# Altium schematic sheet PowerConversion.SchDoc
size B
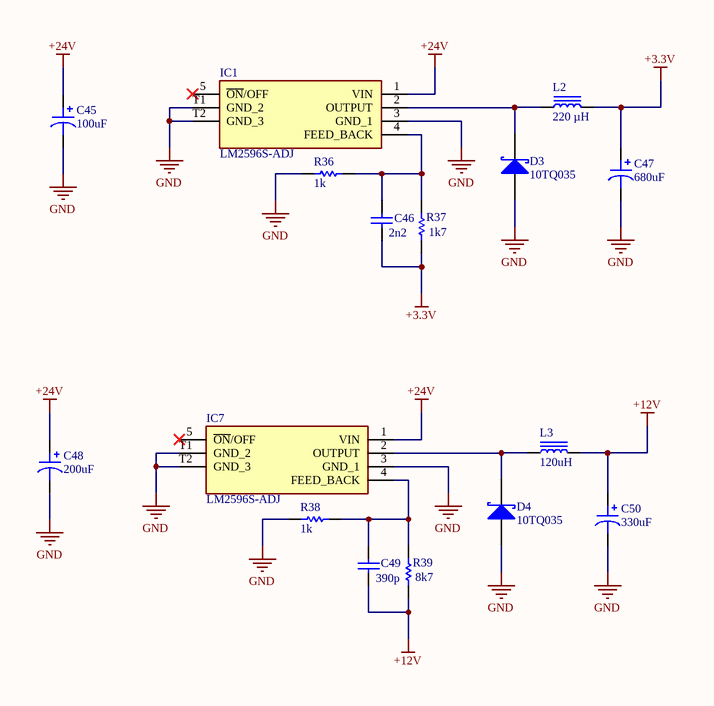
[diagram p0: PowerConversion.SchDoc]

## Parts
C45  100uF  [CAP ALSMD 8.3MM H10.5MM]
C46  value 2n2  [RAD-0.3]  (hidden comment: Cap)
C47  680uF  [CAP ALSMD 8.3MM H10.5MM]
C48  200uF  [CAP ALSMD 8.3MM H10.5MM]
C49  value 390p  [RAD-0.3]  (hidden comment: Cap)
C50  330uF  [CAP ALSMD 8.3MM H10.5MM]
D3  10TQ035  [TO-220AC]
D4  10TQ035  [TO-220AC]
IC1  LM2596S-ADJ  [LM2596SXADJ]
IC7  LM2596S-ADJ  [LM2596SXADJ]
L2  220 µH  [WURTH WE-PD 1260]
L3  120uH  [WURTH WE-PD 1260]
R36  value 1k  [AXIAL-0.3]  (hidden comment: Res1)
R37  value 1k7  [AXIAL-0.3]  (hidden comment: Res1)
R38  value 1k  [AXIAL-0.3]  (hidden comment: Res1)
R39  value 8k7  [AXIAL-0.3]  (hidden comment: Res1)

## Nets
+3.3V: C46.1 C47.1 L2.2 R37.1
+12V: C49.1 C50.1 L3.2 R39.1
+24V: C45.1 C48.1 IC1.1(VIN) IC7.1(VIN)
GND: C45.2 C47.2 C48.2 C50.2 D3.3(A) D4.3(A) IC1.3(GND_1) IC1.T1(GND_2) IC1.T2(GND_3) IC7.3(GND_1) IC7.T1(GND_2) IC7.T2(GND_3) R36.2 R38.2
NetC46_2: C46.2 IC1.4(FEED_BACK) R36.1 R37.2
NetC49_2: C49.2 IC7.4(FEED_BACK) R38.1 R39.2
NetD3_1: D3.1(K) IC1.2(OUTPUT) L2.1
NetD4_1: D4.1(K) IC7.2(OUTPUT) L3.1

Not connected (* = marked no-connect by the designer): IC1 5(~{ON}/OFF)*; IC7 5(~{ON}/OFF)*

## Library data of the parts
C45 C47 C48 C50 = UUX1V101MNL6GS: CAP ALUM 100UF 20% 35V SMD; manufacturer: Nichicon; Capacitance: 100µF; Lifetime @ Temp.: 2000 Hrs @ 105°C; Polarization: Polar; Ripple Current @ High Frequency: 367.9mA @ 10kHz; Ripple Current @ Low Frequency: 283mA @ 120Hz; Surface Mount Land Size: 0.327" L x 0.327" W (8.30mm x 8.30mm); value: 100µF; Part Number: UUX1V101MNL6GS; Applications: General Purpose; componentlink1description: Datasheet; componentlink1url: http://nichicon-us.com/english/products/pdfs/e-uux.pdf; componentlink2description: DigiKey Link; componentlink2url: http://digikey.com/product-detail/en/nichicon/UUX1V101MNL6GS/493-6276-1-ND/3438789; Device Package: Radial, Can - SMD; Height - Seated (Max): 0.413" (10.50mm); lastupdated: 02.09.2020 01:25:15; Lifecycle Status: Active; Minimum Order: 1; Mounting Type: Surface Mount; Operating Temperature: -55°C ~ 105°C; Package / Case: Radial, Can - SMD; packaging: TapeAndReel; partid: 7565; Part Status: Active; price: 0.19; series: UUX; Size / Dimension: 0.315" Dia (8.00mm); Supplier 1: DigiKey; Supplier Part Number 1: 493-6276-1-ND; Tolerance: ±20%; Voltage - Rated: 35V
C46 C49 = Cap: Capacitor; Published: 8-Jun-2000; LatestRevisionDate: 17-Jul-2002; LatestRevisionNote: Re-released for DXP Platform.; PackageReference: RAD-0.3; Publisher: Altium Limited; PackageDescription: Radial Cap, Thru-Hole; 2 Leads; 0.3 in Pin Spacing
D3 D4 = Diode 10TQ035: Schottky Rectifier; Note: Terminal 2 is the TAB and is electrically connected to the cathode; Published: 8-Jun-2000; LatestRevisionDate: 17-Jul-2002; LatestRevisionNote: Re-released for DXP Platform.; DatasheetVersion: PD-2.057B; PackageVersion: Feb-1998; PackageReference: TO-220AC; Publisher: Altium Limited; PackageDescription: TO, Thru-Hole, Vertical, Heatsink Mounted; 3 In-Line Leads (1 Absent); Pitch 2.54 mm; ComponentLink1Description: Manufacturer Link; ComponentLink1URL: http://www.irf.com/; ComponentLink2Description: Datasheet; ComponentLink2URL: http://www.irf.com/product-info/datasheets/data/10tq.pdf
IC1 IC7 = LM2596S-ADJ: Integrated Circuit; Manufacturer_Name: Texas Instruments; Datasheet Link: https://www.ti.com/lit/ds/symlink/lm2596.pdf?HQS=ti-null-null-sf-df-pf-sep-wwe&ts=1592978195629; Height: 4.57mm; Manufacturer_Part_Number: LM2596S-ADJ; Mouser Part Number: 926-LM2596S-ADJ; Mouser Price/Stock: https://www.mouser.co.uk/ProductDetail/Texas-Instruments/LM2596S-ADJ?qs=X1J7HmVL2ZGmRmhAtwKZ2Q%3D%3D
L2 = 744771220: FIXED IND 220UH 960MA 400MOHM SM; Manufacturer: Würth Elektronik; Current - Saturation: 1.2A; DC Resistance (DCR): 400mOhm Max; Frequency - Self Resonant: 3.8MHz; Inductance Frequency - Test: 1 kHz; Material - Core: Ferrite; Shielding: Shielded; Tolerance: ±20%; Type: Drum Core, Wirewound; Part Number: 744771220; ComponentLink1Description: Datasheet; ComponentLink1URL: https://katalog.we-online.de/pbs/datasheet/744771220.pdf; ComponentLink2Description: DigiKey Link; ComponentLink2URL: https://www.digikey.com/en/products/detail/würth-elektronik/744771220/3316840; Current Rating (Amps): 960 mA; Device Package: Nonstandard; Height - Seated (Max): 0.236" (6.00mm); Inductance: 220 µH; LastUpdated: 13.09.2022 07:46:15; Lifecycle Status: Active; Minimum Order: 1; Mounting Type: Surface Mount; Operating Temperature: -40°C ~ 125°C; Package / Case: Nonstandard; Packaging: TapeAndReel; PartId: 5733; Part Status: Active; Price: 1.18; Ratings: AEC-Q200; Series: WE-PD; Size / Dimension: 0.472" L x 0.472" W (12.00mm x 12.00mm); Supplier 1: DigiKey; Supplier Part Number 1: 732-4025-1-ND; Value: 220 µH
L3 = 744771220: FIXED IND 220UH 960MA 400MOHM SM; Manufacturer: Würth Elektronik; Current - Saturation: 1.2A; DC Resistance (DCR): 400mOhm Max; Frequency - Self Resonant: 3.8MHz; Inductance: 220 µH; Inductance Frequency - Test: 1 kHz; Material - Core: Ferrite; Shielding: Shielded; Tolerance: ±20%; Type: Drum Core, Wirewound; Value: 220 µH; Part Number: 744771220; ComponentLink1Description: Datasheet; ComponentLink1URL: https://katalog.we-online.de/pbs/datasheet/744771220.pdf; ComponentLink2Description: DigiKey Link; ComponentLink2URL: https://www.digikey.com/en/products/detail/würth-elektronik/744771220/3316840; Current Rating (Amps): 960 mA; Device Package: Nonstandard; Height - Seated (Max): 0.236" (6.00mm); LastUpdated: 13.09.2022 07:46:15; Lifecycle Status: Active; Minimum Order: 1; Mounting Type: Surface Mount; Operating Temperature: -40°C ~ 125°C; Package / Case: Nonstandard; Packaging: TapeAndReel; PartId: 5733; Part Status: Active; Price: 1.18; Ratings: AEC-Q200; Series: WE-PD; Size / Dimension: 0.472" L x 0.472" W (12.00mm x 12.00mm); Supplier 1: DigiKey; Supplier Part Number 1: 732-4025-1-ND
R36-R39 = Res1: Resistor; Published: 8-Jun-2000; LatestRevisionDate: 17-Jul-2002; LatestRevisionNote: Re-released for DXP Platform.; PackageReference: AXIAL-0.3; Publisher: Altium Limited; PackageDescription: Axial Device, Thru-Hole; 2 Leads; 0.3 in Pin Spacing